# Altium schematic sheet TOP.SCHDOC
size 584 x 381 mm; DrawnBy: M.Zivoder; Engineer: M.Zivoder; DocumentNumber: 1; Revision: 1; SheetNumber: 1; SheetTotal: 7; PageSetup: Record=PageOptions|CenterHorizontal=True|CenterVertical=True|PrintScale=0.69|XCorrection=1.00|YCorrection=1.00|PrintKind=2|BorderSize=5000000|LeftOffset=0|BottomOffset=0|Orientation=2|PaperLength=1000|PaperWidth=1000|Scale=100|PaperSource=7|PrintQuality=600|MediaType=1|DitherType=10|PaperKind=A3|PrintScaleMode=1; DocumentName: Sht1.SCHDOC
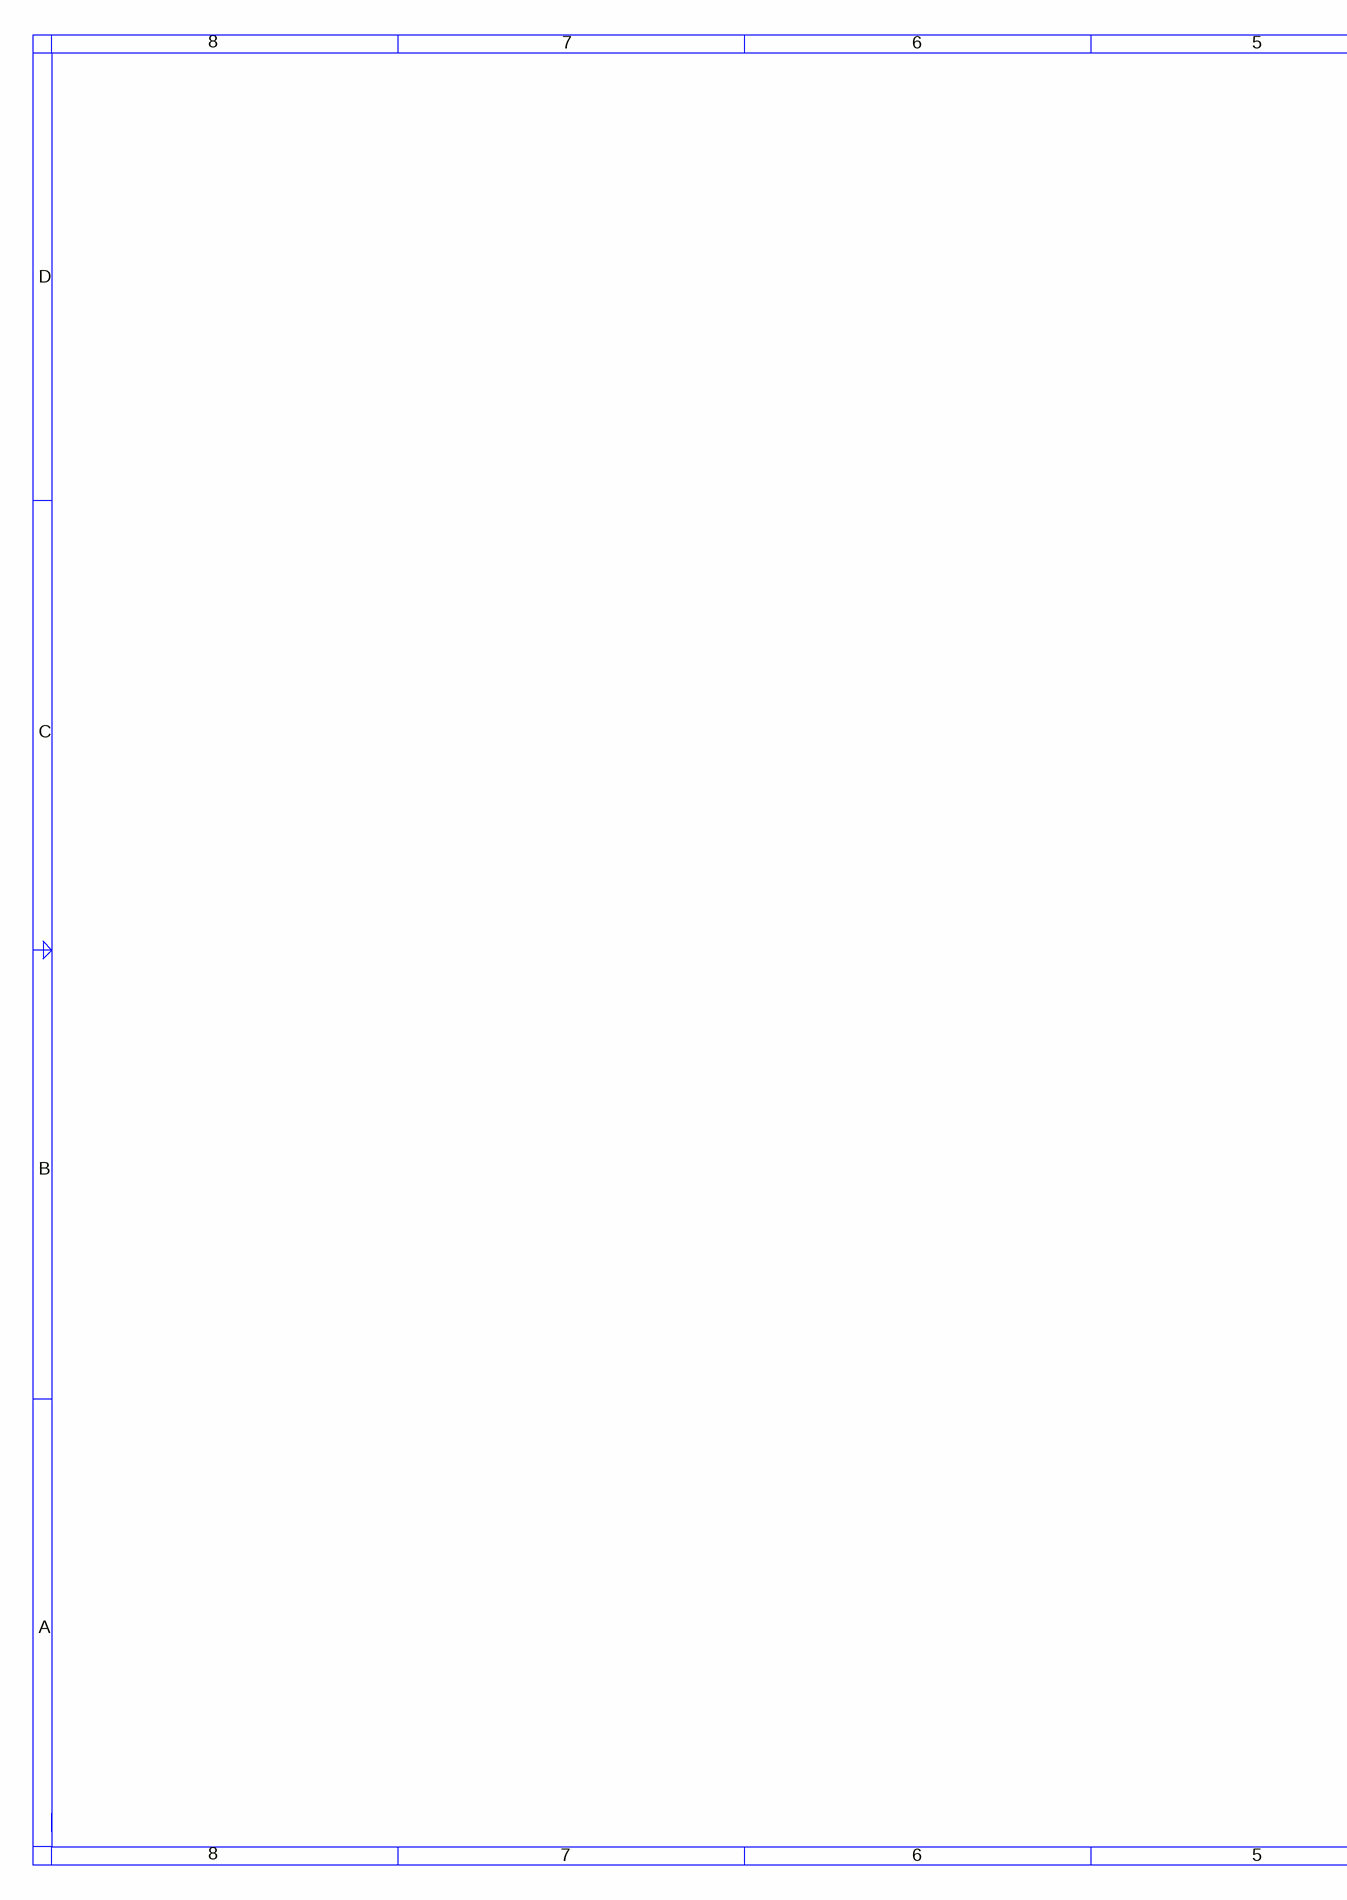
[diagram p0: TOP.SCHDOC, left]
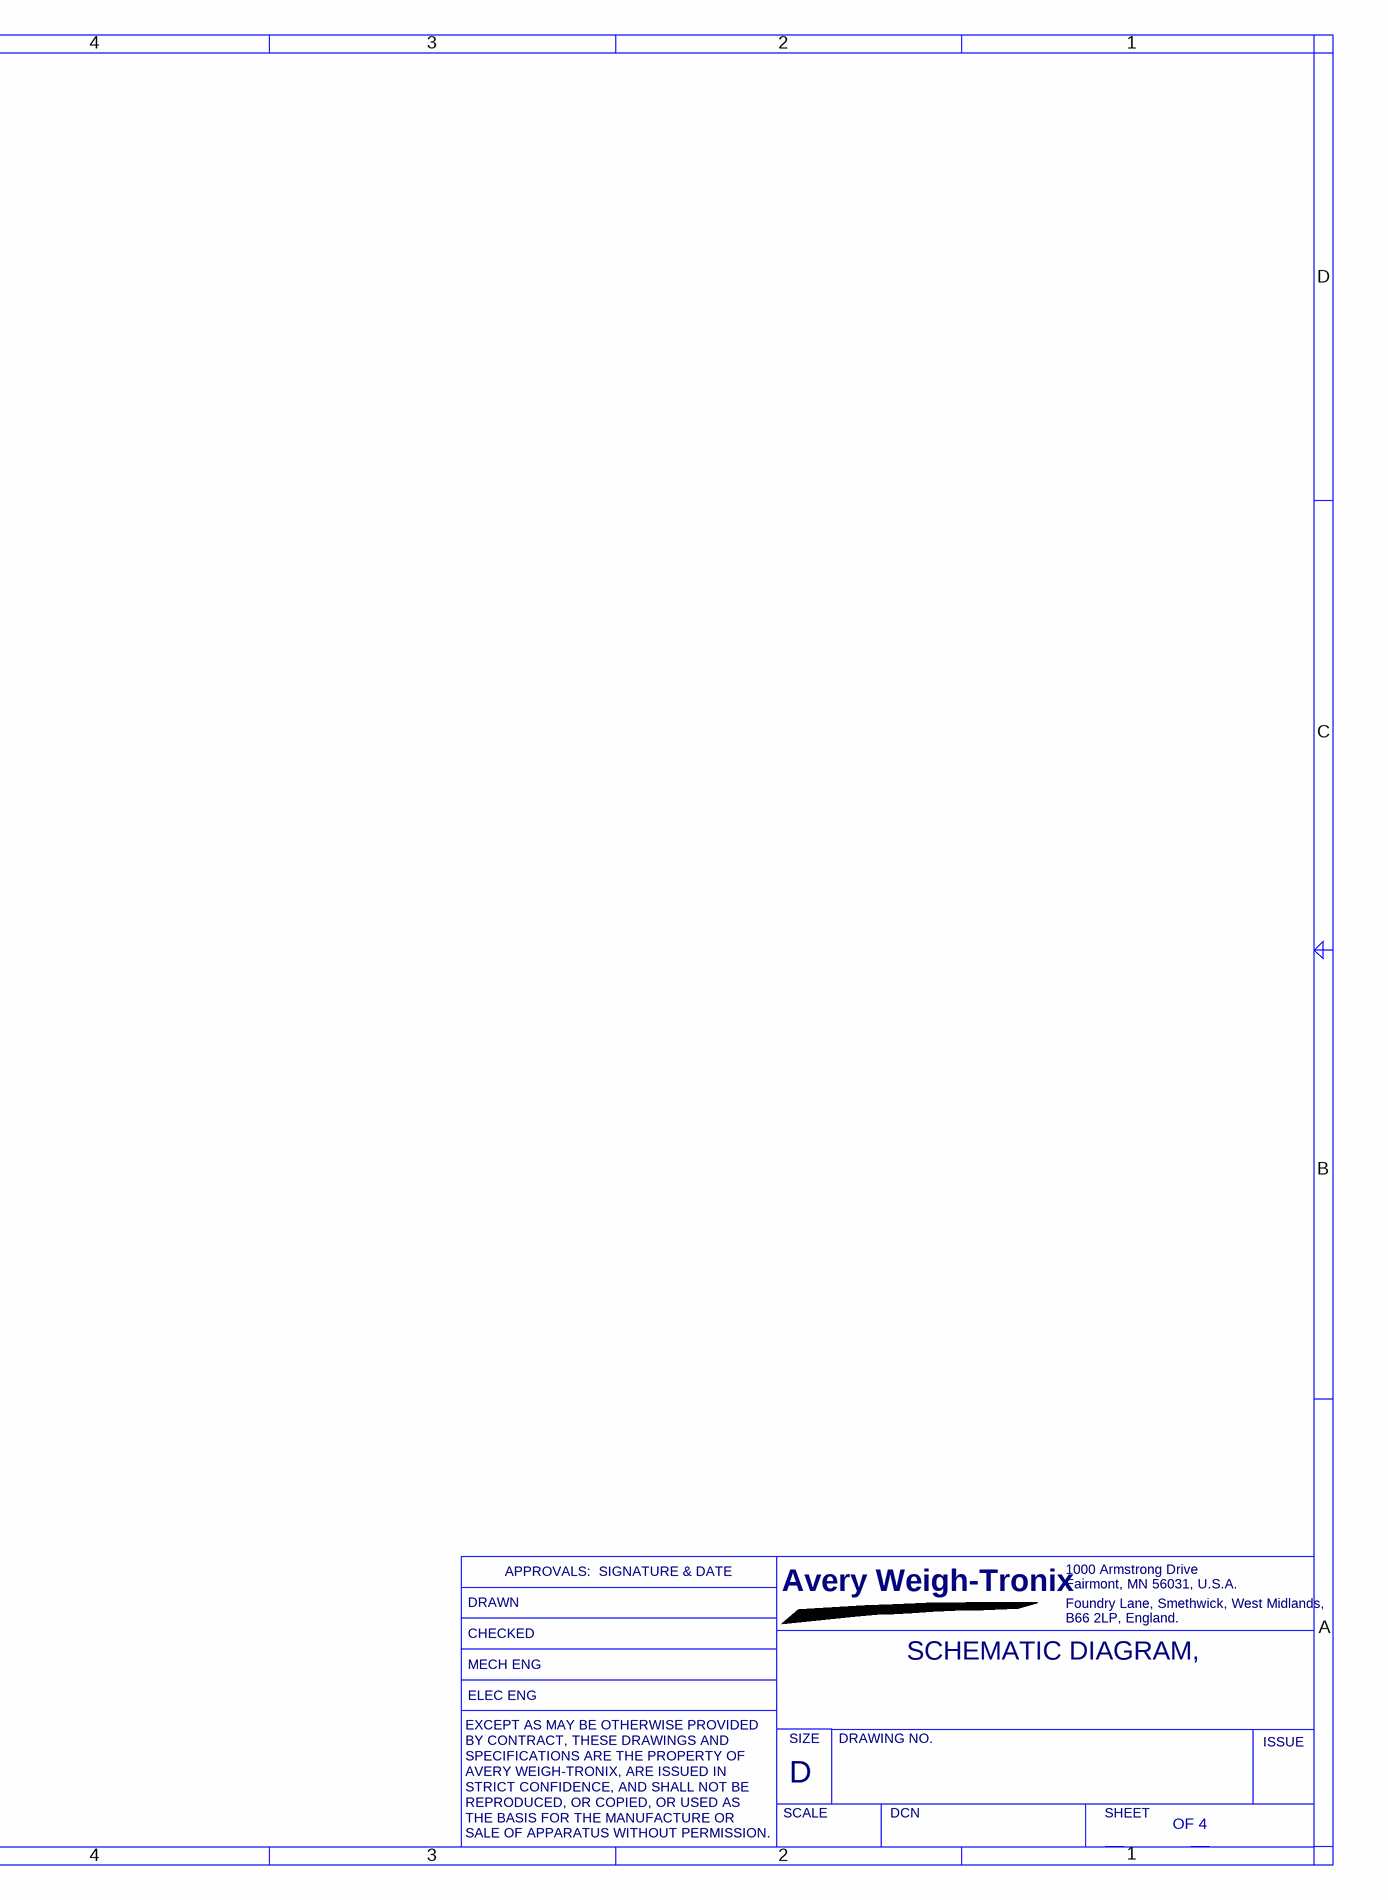
[diagram p1: TOP.SCHDOC, right]

## Notes on the sheet
- 8
- 7
- 6
- 5
- 4
- 3
- 2
- 1
- D
- C
- B
- APPROVALS:  SIGNATURE & DATE
- Avery Weigh-Tronix
- Fairmont, MN 56031, U.S.A.
- 1000 Armstrong Drive
- A
- CHECKED
- DRAWN
- Foundry Lane, Smethwick, West Midlands,
- B66 2LP, England.
- ELEC ENG
- MECH ENG
- SCHEMATIC DIAGRAM,
- SPECIFICATIONS ARE THE PROPERTY OF
- EXCEPT AS MAY BE OTHERWISE PROVIDED
- AVERY WEIGH-TRONIX, ARE ISSUED IN
- BY CONTRACT, THESE DRAWINGS AND
- SIZE
- DRAWING NO.
- ISSUE
- SALE OF APPARATUS WITHOUT PERMISSION.
- STRICT CONFIDENCE, AND SHALL NOT BE
- REPRODUCED, OR COPIED, OR USED AS
- THE BASIS FOR THE MANUFACTURE OR
- SCALE
- DCN
- SHEET
- OF 4